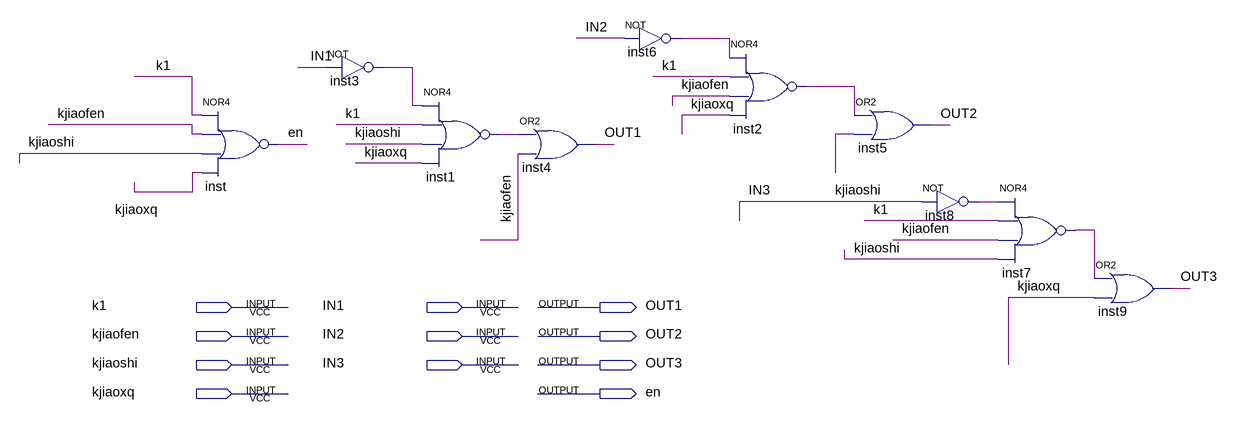
[diagram p0: schematic sheet]
// Quartus schematic baochi.bdf as structural Verilog: 10 symbols, 11 pins
module baochi (
  input  k1,
  input  IN1,
  input  kjiaofen,
  input  IN2,
  input  kjiaoshi,
  input  IN3,
  input  kjiaoxq,
  output OUT1,
  output OUT2,
  output OUT3,
  output en
);

  wire inst1_out, inst2_out, inst3_out, inst6_out, inst7_out, inst8_out;

  nor inst (en, k1, kjiaofen, kjiaoshi, kjiaoxq);
  not inst3 (inst3_out, IN1);
  nor inst1 (inst1_out, inst3_out, k1, kjiaoshi, kjiaoxq);
  or inst4 (OUT1, inst1_out, kjiaofen);
  not inst6 (inst6_out, IN2);
  nor inst2 (inst2_out, inst6_out, k1, kjiaofen, kjiaoxq);
  or inst5 (OUT2, inst2_out, kjiaoshi);
  not inst8 (inst8_out, IN3);
  nor inst7 (inst7_out, inst8_out, k1, kjiaofen, kjiaoshi);
  or inst9 (OUT3, inst7_out, kjiaoxq);
endmodule
